# Altium schematic sheet CONNECTORS.SchDoc
size A4
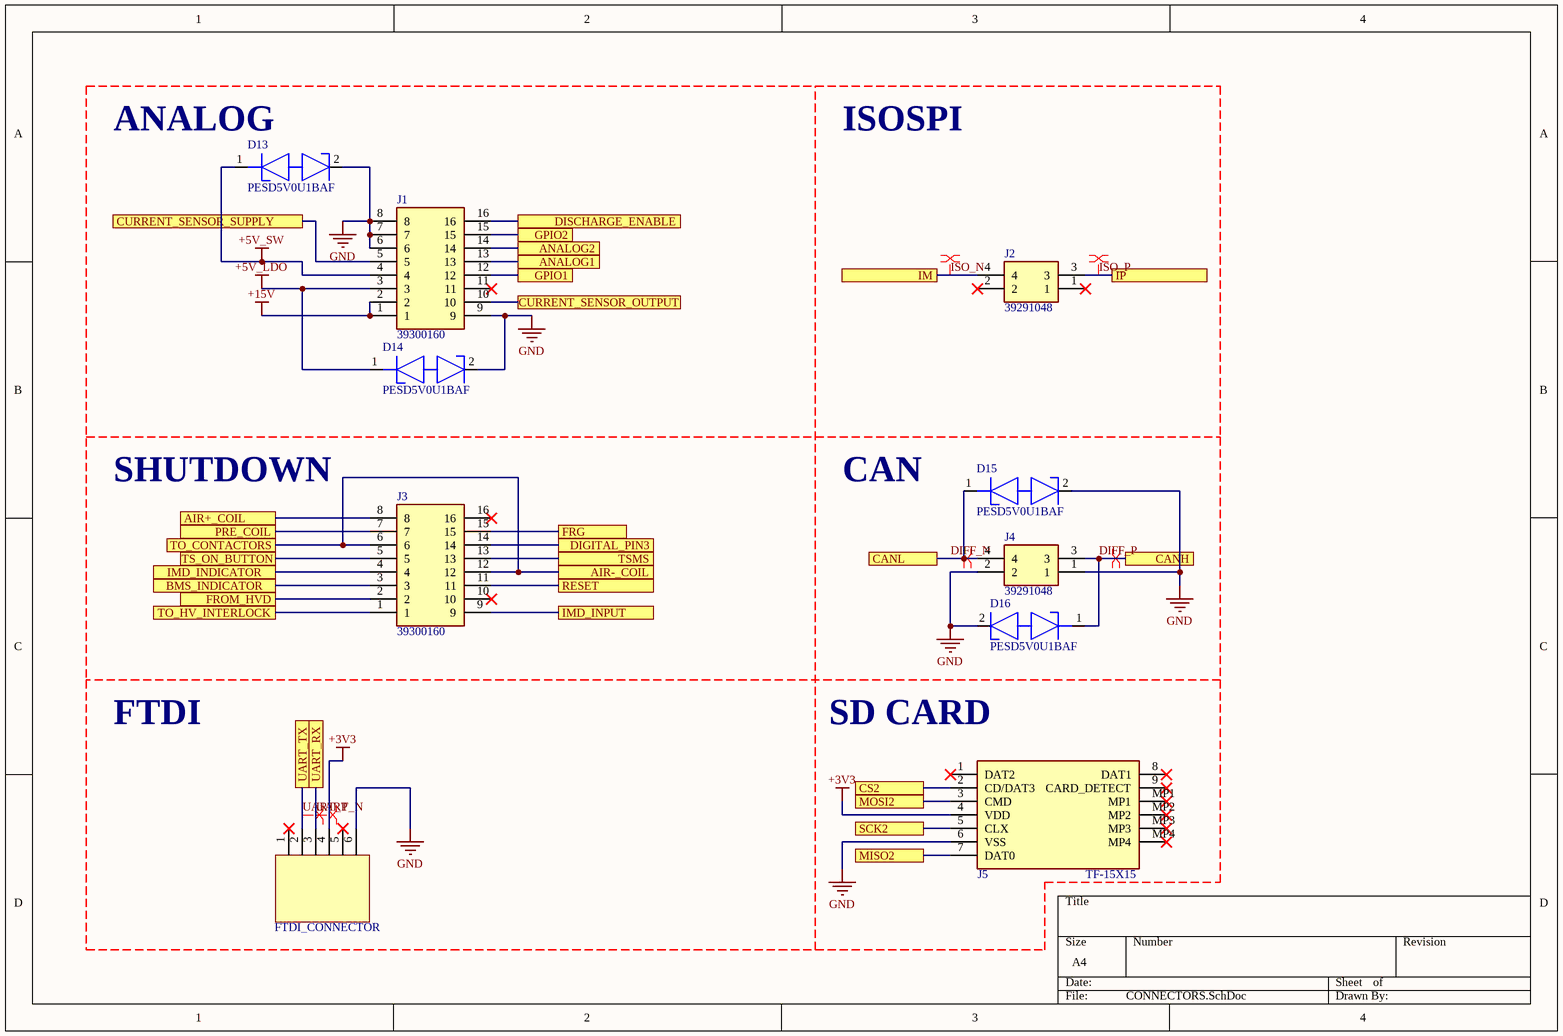
[diagram p0: CONNECTORS.SchDoc]

## Parts
*1  FTDI_connector  [ARDUINO_MEGA_NO_SILK]  (value not drawn)
D13  PESD5V0U1BAF  [SOD2512X110N]
D14  PESD5V0U1BAF  [SOD2512X110N]
D15  PESD5V0U1BAF  [SOD2512X110N]
D16  PESD5V0U1BAF  [SOD2512X110N]
J1  39300160  [39300160]
J2  39291048  [3929104Y]
J3  39300160  [39300160]
J4  39291048  [3929104Y]
J5  TF-15X15  [TF15X15]

## Ports
AIR+_COIL, AIR-_COIL, ANALOG1, ANALOG2, BMS_INDICATOR, CANH, CANL, CS2, CURRENT_SENSOR_OUTPUT, CURRENT_SENSOR_SUPPLY, DIGITAL_PIN3, DISCHARGE_ENABLE, FRG, FROM_HVD, GPIO1, GPIO2, IM, IMD_INDICATOR, IMD_INPUT, IP, MISO2, MOSI2, PRE_COIL, RESET, SCK2, TO_CONTACTORS, TO_HV_INTERLOCK, TS_ON_BUTTON, TSMS, UART_RX, UART_TX

## Nets
+3V3: *1.4 J5.4(VDD)
+5V_LDO: D14.1(K1) J1.3
+5V_SW: D13.1(K1) J1.4
+15V: J1.1 J1.2
GND: *1.6 D13.2(K2) D14.2(K2) D15.2(K2) D16.2(K2) J1.6 J1.7 J1.8 J1.9 J4.1 J4.2 J5.6(VSS)
AIR+_COIL: J3.8 ; port AIR+_COIL
AIR-_COIL: J3.6 J3.12 ; port TO_CONTACTORS, port AIR-_COIL
ANALOG1: J1.13 ; port ANALOG1
ANALOG2: J1.14 ; port ANALOG2
BMS_INDICATOR: J3.3 ; port BMS_INDICATOR
CS2: J5.2(CD/DAT3) ; port CS2
CURRENT_SENSOR_OUTPUT: J1.10 ; port CURRENT_SENSOR_OUTPUT
CURRENT_SENSOR_SUPPLY: J1.5 ; port CURRENT_SENSOR_SUPPLY
DIFF_N: D15.1(K1) J4.4 ; port CANL
DIFF_P: D16.1(K1) J4.3 ; port CANH
DIGITAL_PIN3: J3.14 ; port DIGITAL_PIN3
DISCHARGE_ENABLE: J1.16 ; port DISCHARGE_ENABLE
FRG: J3.15 ; port FRG
FROM_HVD: J3.2 ; port FROM_HVD
GPIO1: J1.12 ; port GPIO1
GPIO2: J1.15 ; port GPIO2
IMD_INDICATOR: J3.4 ; port IMD_INDICATOR
IMD_INPUT: J3.9 ; port IMD_INPUT
ISO_N: J2.4 ; port IM
ISO_P: J2.3 ; port IP
MISO2: J5.7(DAT0) ; port MISO2
MOSI2: J5.3(CMD) ; port MOSI2
PRE_COIL: J3.7 ; port PRE_COIL
RESET: J3.11 ; port RESET
SCK2: J5.5(CLX) ; port SCK2
TO_HV_INTERLOCK: J3.1 ; port TO_HV_INTERLOCK
TS_ON_BUTTON: J3.5 ; port TS_ON_BUTTON
TSMS: J3.13 ; port TSMS
UART_N: *1.3 ; port UART_RX
UART_P: *1.2 ; port UART_TX

Not connected (* = marked no-connect by the designer): *1 1* 5(2)*; J1 11*; J2 1* 2*; J3 10* 16*; J5 1(DAT2)* 8(DAT1)* 9(CARD_DETECT)* MP1* MP2* MP3* MP4*

## Layout directives
differential pair: DIFF_N, DIFF_P, ISO_N, ISO_P, UART_N, UART_P

## Notes on the sheet
- (near D13) ANALOG
- ISOSPI
- SHUTDOWN
- CAN
- FTDI
- (near J5) SD CARD
- (in symbol FTDI_connector) FTDI_CONNECTOR

## Library data of the parts
D13-D16 = PESD5V0U1BAF: Diode ESD (Bi-directional); Manufacturer_Name: Nexperia; Datasheet Link: https://assets.nexperia.com/documents/data-sheet/PESD5V0U1BA.pdf; Height: 1.1mm; Manufacturer_Part_Number: PESD5V0U1BAF; Mouser Part Number: 771-PESD5V0U1BAF; Mouser Price/Stock: https://www.mouser.co.uk/ProductDetail/Nexperia/PESD5V0U1BAF?qs=45Avz0nZxhs2zrCm2E4eDw%3D%3D
J1 J3 = 39300160: Connector; Manufacturer_Name: Molex; Datasheet Link: https://www.molex.com/pdm_docs/sd/039300020_sd.pdf; Height: 10mm; Manufacturer_Part_Number: 39300160
J2 J4 = 39291048: Connector; Manufacturer_Name: Molex; Datasheet Link: https://www.molex.com/pdm_docs/sd/039291027_sd.pdf; Height: 10mm; Manufacturer_Part_Number: 39291048
J5 = TF-15X15: Connector; Manufacturer_Name: SOFNG; Datasheet Link: https://datasheet.lcsc.com/szlcsc/SOFNG-TF-15-15_C111196.pdf; Height: 1.85mm; Manufacturer_Part_Number: TF-15X15